# Altium schematic sheet Analog Out.SchDoc
size A; SheetNumber: 2; SheetTotal: 2
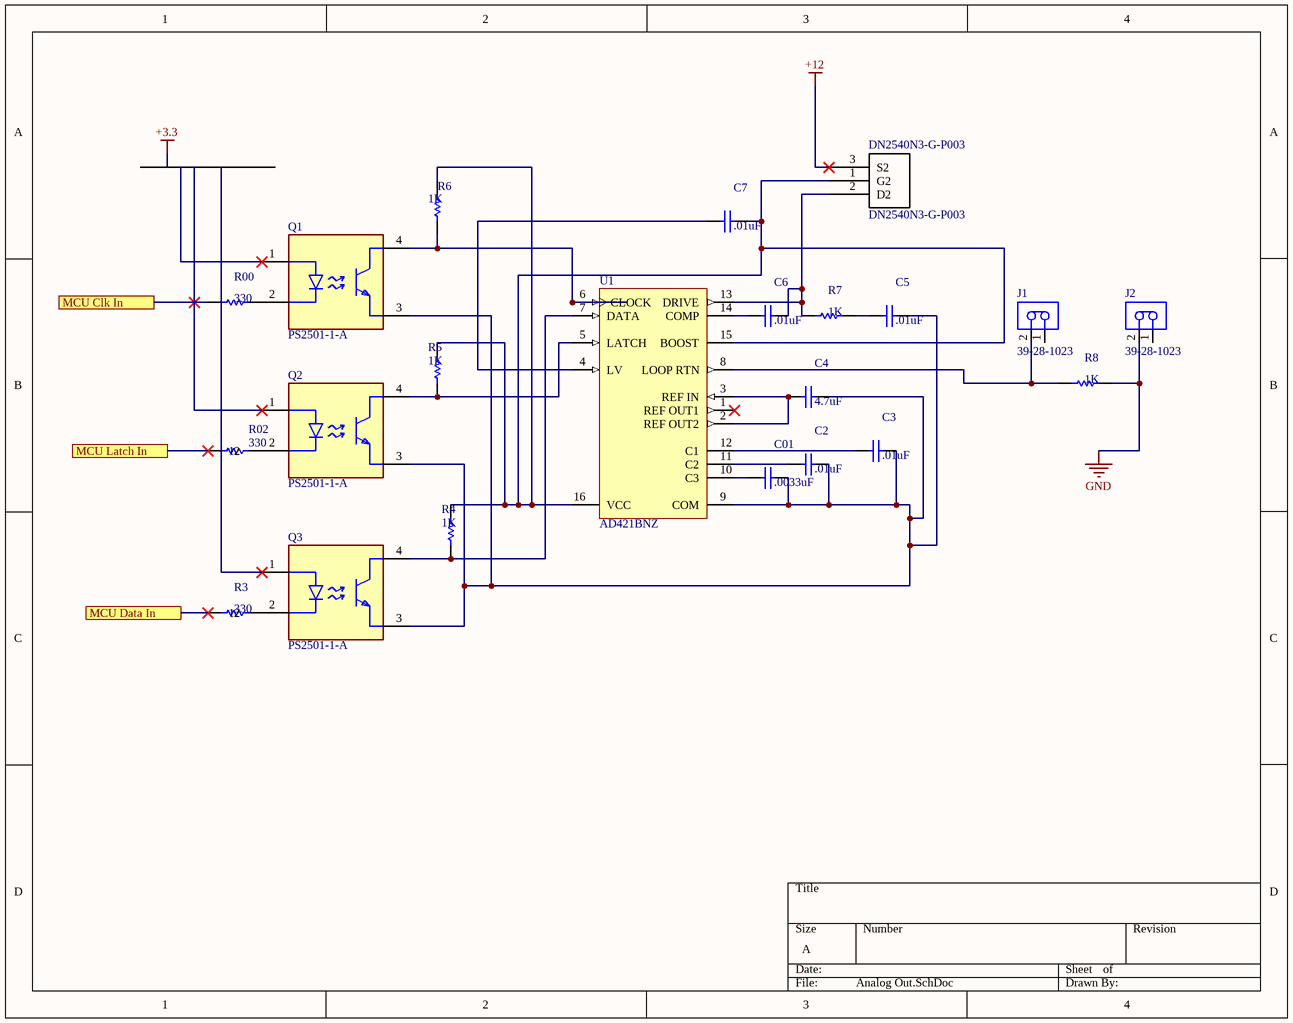
[diagram p0: Analog Out.SchDoc]

## Parts
C01  value .0033uF  [RAD-0.3]  (hidden comment: Cap)
C2  value .01uF  [RAD-0.3]  (hidden comment: Cap)
C3  value .01uF  [RAD-0.3]  (hidden comment: Cap)
C4  value 4.7uF  [RAD-0.3]  (hidden comment: Cap)
C5  value .01uF  [RAD-0.3]  (hidden comment: Cap)
C6  value .01uF  [RAD-0.3]  (hidden comment: Cap)
C7  value .01uF  [RAD-0.3]  (hidden comment: Cap)
DN2540N3-G-P003  DN2540N3-G-P003  [TO-92]
J1  39-28-1023  [MOLX-39-28-1023-2_V]
J2  39-28-1023  [MOLX-39-28-1023-2_V]
Q1  PS2501-1-A  [FP-PS2501-1-A-MFG]
Q2  PS2501-1-A  [FP-PS2501-1-A-MFG]
Q3  PS2501-1-A  [FP-PS2501-1-A-MFG]
R00  value 330  [AXIAL-0.3]  (hidden comment: Res1)
R02  value 330  [AXIAL-0.3]  (hidden comment: Res1)
R3  value 330  [AXIAL-0.3]  (hidden comment: Res1)
R4  value 1K  [AXIAL-0.3]  (hidden comment: Res1)
R5  value 1K  [AXIAL-0.3]  (hidden comment: Res1)
R6  value 1K  [AXIAL-0.3]  (hidden comment: Res1)
R7  value 1K  [AXIAL-0.3]  (hidden comment: Res1)
R8  value 1K  [AXIAL-0.3]  (hidden comment: Res1)
U1  AD421BNZ  [N-16]

## Ports
MCU Clk In, MCU Data In, MCU Latch In

## Nets
+12: DN2540N3-G-P003.3(S2)
GND: J2.2 R8.2
MCU Clk In: R00.1 ; port MCU Clk In
MCU Data In: R3.1 ; port MCU Data In
MCU Latch In: R02.1 ; port MCU Latch In
NetC01_1: C01.1 U1.10(C3)
NetC01_2: C01.2 C2.2 C3.2 C4.2 C5.2 Q1.3(E) Q2.3(E) Q3.3(E) U1.9(COM)
NetC2_1: C2.1 U1.11(C2)
NetC3_1: C3.1 U1.12(C1)
NetC4_1: C4.1 U1.2(REF_OUT2) U1.3(REF_IN)
NetC5_1: C5.1 R7.2
NetC6_1: C6.1 U1.14(COMP)
NetC6_2: C6.2 DN2540N3-G-P003.2(D2) R7.1 U1.13(DRIVE)
NetC7_1: C7.1 U1.4(LV)
NetC7_2: C7.2 DN2540N3-G-P003.1(G2) R4.2 R5.2 R6.2 U1.15(BOOST) U1.16(VCC)
NetJ1_2: J1.2 R8.1 U1.8(LOOP_RTN)
NetQ1_2: Q1.2(C) R00.2
NetQ1_4: Q1.4(C) R6.1 U1.6(CLOCK)
NetQ2_2: Q2.2(C) R02.2
NetQ2_4: Q2.4(C) R5.1 U1.5(LATCH)
NetQ3_2: Q3.2(C) R3.2
NetQ3_4: Q3.4(C) R4.1 U1.7(DATA)

Not connected (* = marked no-connect by the designer): J1 1; J2 1; Q1 1(A)*; Q2 1(A)*; Q3 1(A)*; U1 1(REF_OUT1)*

## Library data of the parts
C01-C7 = Cap: Capacitor; Published: 8-Jun-2000; PackageReference: RAD-0.3; Publisher: Altium Limited; PackageDescription: Radial Cap, Thru-Hole; 2 Leads; 0.3 in Pin Spacing; LatestRevisionDate: 17-Jul-2002; LatestRevisionNote: Re-released for DXP Platform.
J1 J2 = CMP-2000-05244-1: Female Header, Pitch 4.2 mm, 1 x 2 Position, Height 12.8 mm, Tail Length 3.5 mm, -40 to 105 degC, RoHS; Manufacturer: Molex; No. of Poles: 2; Working Voltage: 250V; No. of Rows: 1; Current Rating: 13A; Contact Termination: Solder; No. of Contacts: 4; Connector Body Material: –; Voltage Rating V AC: 600V; Mounting Orientation: Straight; Pitch Spacing: 4.2mm; Connector Mounting: PCB; Connector Type: RectangularPower; Manufacturer URL: http://www.molex.com/; Contact Plating: Tin; Gender: Header; Lead Spacing: 4.2mm; Colour: Clear; Series: Mini-FitJr; No. of Ways: 2; MSL: –; Connector Insert Type: Header; Flammability Rating: UL94V-2; Datasheet URL: https://datasheet.ciiva.com/11746/0900766b80460d9e-11746456.pdf; Termination Method: Solder; Mounting Type: PCBoard; Contact Material: Brass; Datasheet Version: Rev. F, 05/2004; SVHC: –; Connector Mounting Orientation: PCB; Contact Gender: –
Q1-Q3 = CMP-13576-000004-1: OPTOISOLATOR 5KV TRANS 4DIP; Reverse Breakdown Voltage: 6V; Collector Emitter Saturation Voltage: 300mV; Current Transfer Ratio: 600%; Collector Emitter Voltage (VCEO): 80V; Forward Current: 80mA; Input Type: DC; Number of Elements: 1; Forward Voltage: 1.4V; Number of Pins: 4; Case/Package: PDIP; Isolation Voltage: 5kV; Max Operating Temperature: 100°C; Radiation Hardening: No; RoHS Compliant: Yes; Min Operating Temperature: -55°C; Mount: Through Hole
R00 R02-R8 = Res1: Resistor; Published: 8-Jun-2000; LatestRevisionDate: 17-Jul-2002; LatestRevisionNote: Re-released for DXP Platform.; PackageReference: AXIAL-0.3; Publisher: Altium Limited; PackageDescription: Axial Device, Thru-Hole; 2 Leads; 0.3 in Pin Spacing
U1 = CMP-0318-00282-2: Single 16-Bit Loop-Powered Digital-to-Analog Converter, 4 to 20 mA, -40 to +85 degC, N-16, Pb-Free, Tube; Manufacturer: Analog Devices; Generic Part Number: AD421; Settling Time: 8ms; Resolution (Bits): 16; Op Pwr Diss: 1.95mW; Max V+: 5.05V; Single Supply: Yes; # DAC Outputs: 1; ComponentLink2Description: Datasheet; ComponentLink4Description: Product URL; ComponentLink1Description: Manufacturer URL; PackageReference: N-16; Code_JEDEC: MS-001; ComponentLink3URL: http://www.analog.com/static/imported-files/packages/44768431550332N_16.pdf; ComponentLink1URL: http://www.analog.com/en/index.html; PackageDescription: 16-Lead Plastic Dual In-Line Package [PDIP] Narrow Body; Packing: Tube; ComponentLink2URL: http://www.analog.com/static/imported-files/data_sheets/AD421.pdf; ComponentLink3Description: Package Specification; Mounting Technology: Through Hole; ComponentLink4URL: http://www.analog.com/en/digital-to-analog-converters/da-converters/ad421/products/product.html; RevisionNote: Component URL fixed; DatasheetVersion: Rev.C; PackageVersion: 070706-A; RoHS: Y; PartNumber: AD421BNZ